# Altium schematic sheet 12 - MIPI-LVDS-RGB.SchDoc
size B; CompanyName: Microchip Technology Inc.; Organization: Microchip Technology; Address1: 2355 West Chandler Blvd.; Address2: Chandler, AZ  85224; Address4: USA; DocumentNumber: 12; SheetNumber: 12; SheetTotal: 15; SheetTitle: MIPI LVDS Connectors; Time: Time
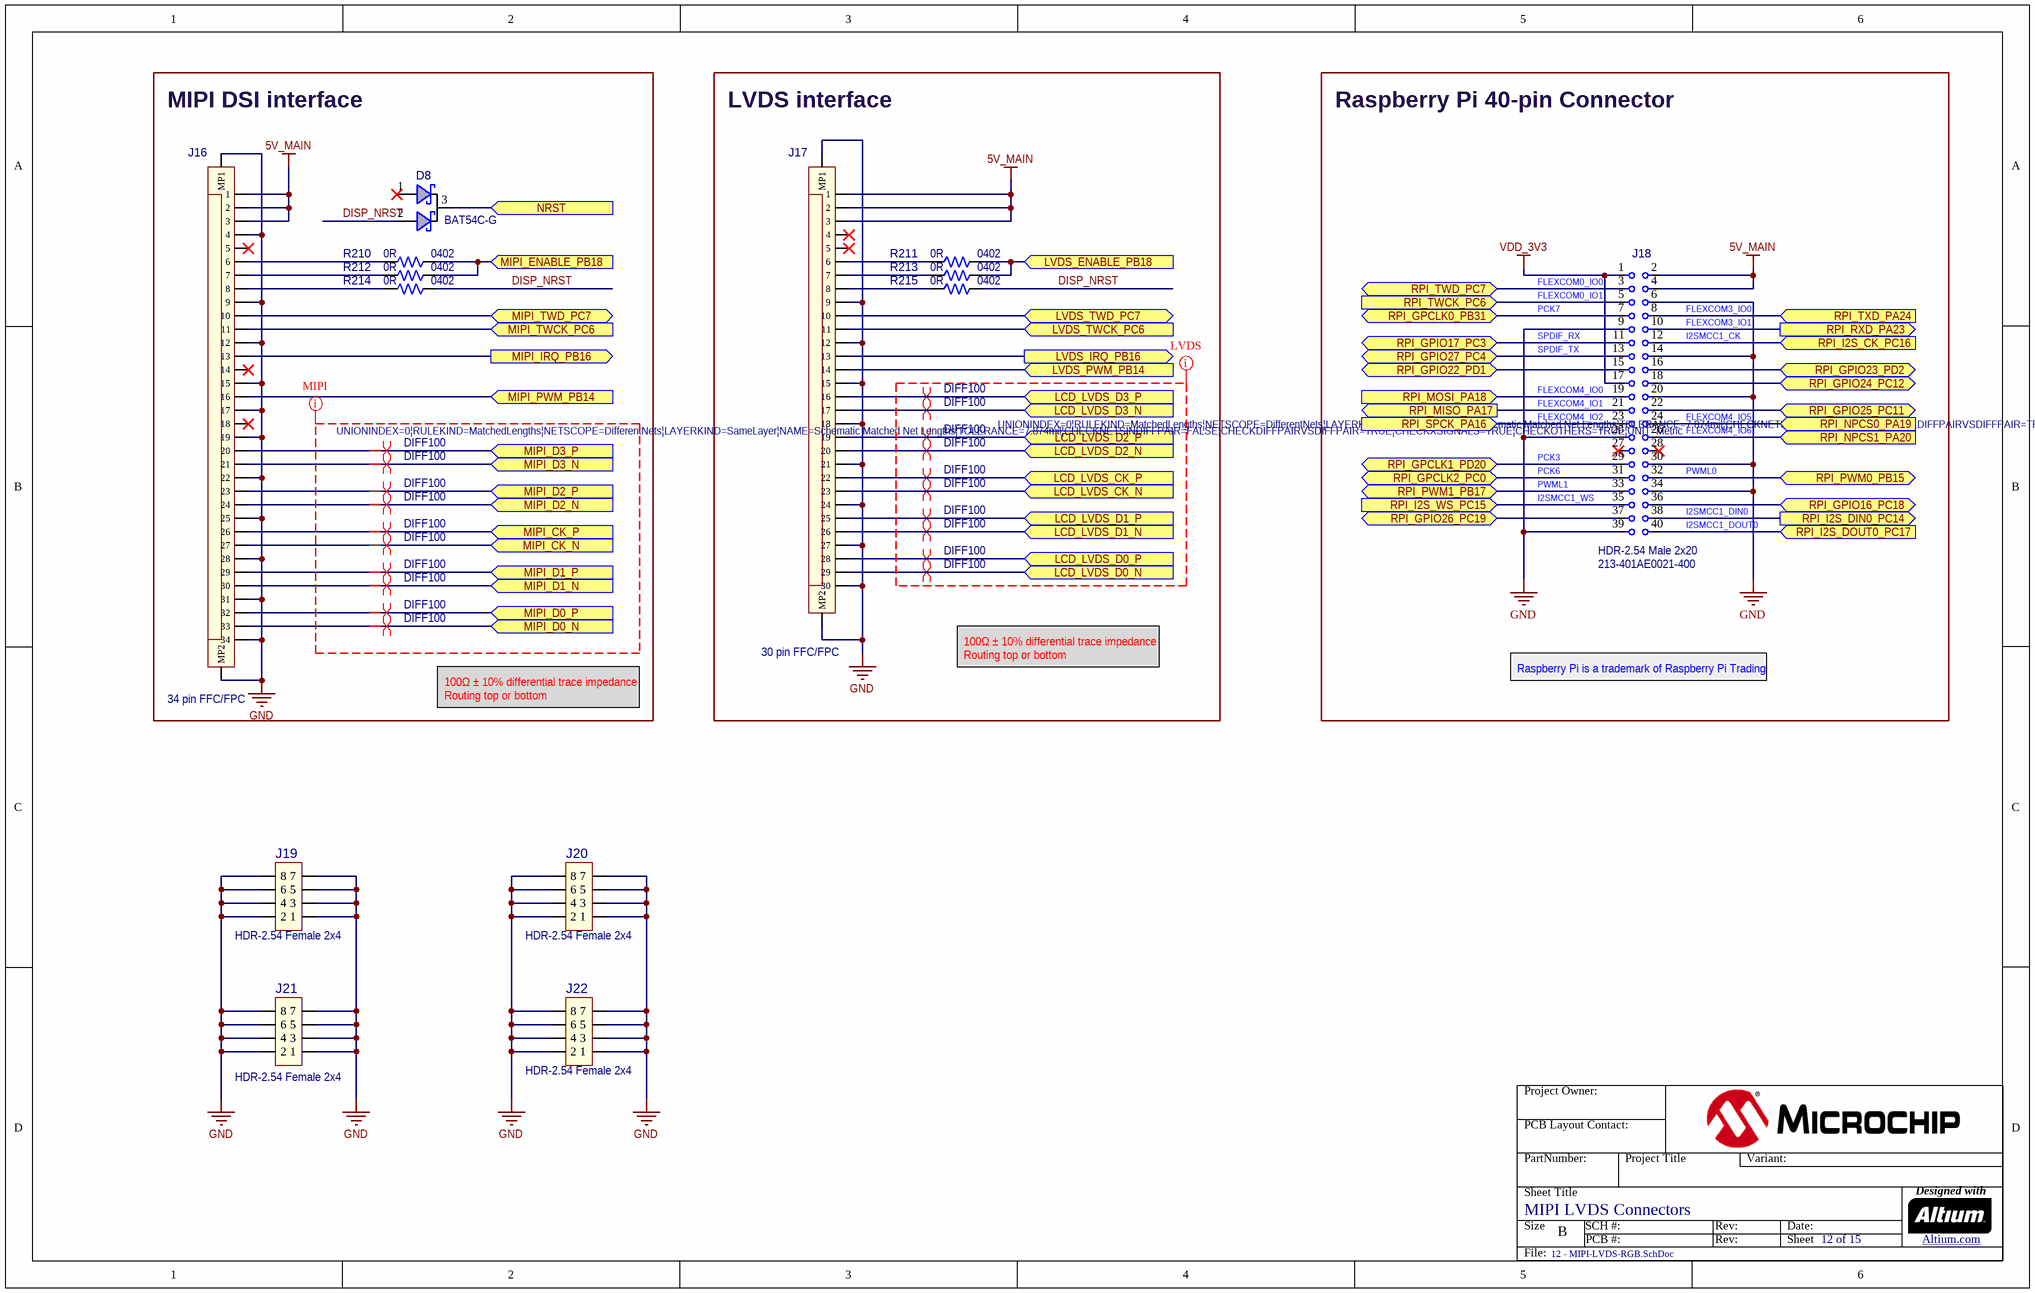
[diagram p0: 12 - MIPI-LVDS-RGB.SchDoc]

## Parts
D8  value BAT54C-G  [SOT-23-3]  (hidden comment: Diode Schottky Dual CK)
J16  value 34 pin FFC/FPC  [CON_FPC_0.5_FEMALE_2X17_SMD_AMPHENOL_F314-1A7H1-11034]  (hidden comment: CON FFC 1x34)
J17  value 30 pin FFC/FPC  [CON_FPC_0.5_FEMALE_2X15_SMD_MLX_52559-3052]  (hidden comment: CON FFC 1x30)
J18  value HDR-2.54 Male 2x20  Manufacturer Part Number 1: 213-401AE0021-400  [HDR_M_2.54_2x20]  (hidden comment: Header 2x20)
J19  value HDR-2.54 Female 2x4  [HDR_F_2.54_2x4]  (hidden comment: Header 2x4)
J20  value HDR-2.54 Female 2x4  [HDR_F_2.54_2x4]  (hidden comment: Header 2x4)
J21  value HDR-2.54 Female 2x4  [HDR_F_2.54_2x4]  (hidden comment: Header 2x4)
J22  value HDR-2.54 Female 2x4  [HDR_F_2.54_2x4]  (hidden comment: Header 2x4)
R210  value 0R  Package: 0402  [RES_C_0402]  (hidden comment: Resistor)
R211  value 0R  Package: 0402  [RES_C_0402]  (hidden comment: Resistor)
R212  value 0R  Package: 0402  [RES_C_0402]  (hidden comment: Resistor)
R213  value 0R  Package: 0402  [RES_C_0402]  (hidden comment: Resistor)
R214  value 0R  Package: 0402  [RES_C_0402]  (hidden comment: Resistor)
R215  value 0R  Package: 0402  [RES_C_0402]  (hidden comment: Resistor)

## Blocks framed on the sheet
MIPI DSI interface: D8 J16 R210 R212 R214
LVDS interface: J17 R211 R213 R215
Raspberry Pi 40-pin Connector: J18

## Ports
LCD_LVDS_CK_N (in), LCD_LVDS_CK_P (in), LCD_LVDS_D0_N (in), LCD_LVDS_D0_P (in), LCD_LVDS_D1_N (in), LCD_LVDS_D1_P (in), LCD_LVDS_D2_N (in), LCD_LVDS_D2_P (in), LCD_LVDS_D3_N (in), LCD_LVDS_D3_P (in), LVDS_ENABLE_PB18 (in), LVDS_IRQ_PB16 (out), LVDS_PWM_PB14 (in), LVDS_TWCK_PC6 (in), LVDS_TWD_PC7 (bidir), MIPI_CK_N (in), MIPI_CK_P (in), MIPI_D0_N (in), MIPI_D0_P (in), MIPI_D1_N (in), MIPI_D1_P (in), MIPI_D2_N (in), MIPI_D2_P (in), MIPI_D3_N (in), MIPI_D3_P (in), MIPI_ENABLE_PB18 (in), MIPI_IRQ_PB16 (out), MIPI_PWM_PB14 (in), MIPI_TWCK_PC6 (in), MIPI_TWD_PC7 (bidir), NRST (in), RPI_GPCLK0_PB31 (bidir), RPI_GPCLK1_PD20 (bidir), RPI_GPCLK2_PC0 (bidir), RPI_GPIO16_PC18 (bidir), RPI_GPIO17_PC3 (bidir), RPI_GPIO22_PD1 (bidir), RPI_GPIO23_PD2 (bidir), RPI_GPIO24_PC12 (bidir), RPI_GPIO25_PC11 (bidir), RPI_GPIO26_PC19 (bidir), RPI_GPIO27_PC4 (bidir), RPI_I2S_CK_PC16 (in), RPI_I2S_DIN0_PC14 (out), RPI_I2S_DOUT0_PC17 (in), RPI_I2S_WS_PC15 (in), RPI_MISO_PA17 (out), RPI_MOSI_PA18 (in), RPI_NPCS0_PA19 (in), RPI_NPCS1_PA20 (in), RPI_PWM0_PB15 (bidir), RPI_PWM1_PB17 (bidir), RPI_RXD_PA23 (out), RPI_SPCK_PA16 (in), RPI_TWCK_PC6 (in), RPI_TWD_PC7 (bidir), RPI_TXD_PA24 (in)

## Nets
5V_MAIN: J16.1 J16.2 J16.3 J17.1 J17.2 J17.3 J18.2 J18.4
GND: J16.4 J16.9 J16.12 J16.15 J16.17 J16.19 J16.22 J16.25 J16.28 J16.31 J16.34 J16.MP1 J16.MP2 J17.9 J17.12 J17.15 J17.18 J17.21 J17.24 J17.27 J17.30 J17.MP1 J17.MP2 J18.6 J18.9 J18.14 J18.20 J18.25 J18.30 J18.34 J18.39 J19.1 J19.2 J19.3 J19.4 J19.5 J19.6 J19.7 J19.8 J20.1 J20.2 J20.3 J20.4 J20.5 J20.6 J20.7 J20.8 J21.1 J21.2 J21.3 J21.4 J21.5 J21.6 J21.7 J21.8 J22.1 J22.2 J22.3 J22.4 J22.5 J22.6 J22.7 J22.8
VDD_3V3: J18.1 J18.17
DISP_NRST: D8.2(A) R214.2 R215.2
LCD_LVDS_CK_N: J17.23 ; port LCD_LVDS_CK_N
LCD_LVDS_CK_P: J17.22 ; port LCD_LVDS_CK_P
LCD_LVDS_D0_N: J17.29 ; port LCD_LVDS_D0_N
LCD_LVDS_D0_P: J17.28 ; port LCD_LVDS_D0_P
LCD_LVDS_D1_N: J17.26 ; port LCD_LVDS_D1_N
LCD_LVDS_D1_P: J17.25 ; port LCD_LVDS_D1_P
LCD_LVDS_D2_N: J17.20 ; port LCD_LVDS_D2_N
LCD_LVDS_D2_P: J17.19 ; port LCD_LVDS_D2_P
LCD_LVDS_D3_N: J17.17 ; port LCD_LVDS_D3_N
LCD_LVDS_D3_P: J17.16 ; port LCD_LVDS_D3_P
LVDS_ENABLE_PB18: R211.2 R213.2 ; port LVDS_ENABLE_PB18
LVDS_IRQ_PB16: J17.13 ; port LVDS_IRQ_PB16
LVDS_PWM_PB14: J17.14 ; port LVDS_PWM_PB14
LVDS_TWCK_PC6: J17.11 ; port LVDS_TWCK_PC6
LVDS_TWD_PC7: J17.10 ; port LVDS_TWD_PC7
MIPI_CK_N: J16.27 ; port MIPI_CK_N
MIPI_CK_P: J16.26 ; port MIPI_CK_P
MIPI_D0_N: J16.33 ; port MIPI_D0_N
MIPI_D0_P: J16.32 ; port MIPI_D0_P
MIPI_D1_N: J16.30 ; port MIPI_D1_N
MIPI_D1_P: J16.29 ; port MIPI_D1_P
MIPI_D2_N: J16.24 ; port MIPI_D2_N
MIPI_D2_P: J16.23 ; port MIPI_D2_P
MIPI_D3_N: J16.21 ; port MIPI_D3_N
MIPI_D3_P: J16.20 ; port MIPI_D3_P
MIPI_ENABLE_PB18: R210.2 R212.2 ; port MIPI_ENABLE_PB18
MIPI_IRQ_PB16: J16.13 ; port MIPI_IRQ_PB16
MIPI_PWM_PB14: J16.16 ; port MIPI_PWM_PB14
MIPI_TWCK_PC6: J16.11 ; port MIPI_TWCK_PC6
MIPI_TWD_PC7: J16.10 ; port MIPI_TWD_PC7
NRST: D8.3(KK) ; port NRST
RPI_GPCLK0_PB31: J18.7 ; port RPI_GPCLK0_PB31
RPI_GPCLK1_PD20: J18.29 ; port RPI_GPCLK1_PD20
RPI_GPCLK2_PC0: J18.31 ; port RPI_GPCLK2_PC0
RPI_GPIO16_PC18: J18.36 ; port RPI_GPIO16_PC18
RPI_GPIO17_PC3: J18.11 ; port RPI_GPIO17_PC3
RPI_GPIO22_PD1: J18.15 ; port RPI_GPIO22_PD1
RPI_GPIO23_PD2: J18.16 ; port RPI_GPIO23_PD2
RPI_GPIO24_PC12: J18.18 ; port RPI_GPIO24_PC12
RPI_GPIO25_PC11: J18.22 ; port RPI_GPIO25_PC11
RPI_GPIO26_PC19: J18.37 ; port RPI_GPIO26_PC19
RPI_GPIO27_PC4: J18.13 ; port RPI_GPIO27_PC4
RPI_I2S_CK_PC16: J18.12 ; port RPI_I2S_CK_PC16
RPI_I2S_DIN0_PC14: J18.38 ; port RPI_I2S_DIN0_PC14
RPI_I2S_DOUT0_PC17: J18.40 ; port RPI_I2S_DOUT0_PC17
RPI_I2S_WS_PC15: J18.35 ; port RPI_I2S_WS_PC15
RPI_MISO_PA17: J18.21 ; port RPI_MISO_PA17
RPI_MOSI_PA18: J18.19 ; port RPI_MOSI_PA18
RPI_NPCS0_PA19: J18.24 ; port RPI_NPCS0_PA19
RPI_NPCS1_PA20: J18.26 ; port RPI_NPCS1_PA20
RPI_PWM0_PB15: J18.32 ; port RPI_PWM0_PB15
RPI_PWM1_PB17: J18.33 ; port RPI_PWM1_PB17
RPI_RXD_PA23: J18.10 ; port RPI_RXD_PA23
RPI_SPCK_PA16: J18.23 ; port RPI_SPCK_PA16
RPI_TWCK_PC6: J18.5 ; port RPI_TWCK_PC6
RPI_TWD_PC7: J18.3 ; port RPI_TWD_PC7
RPI_TXD_PA24: J18.8 ; port RPI_TXD_PA24
NetJ16_6: J16.6 R210.1
NetJ16_7: J16.7 R212.1
NetJ16_8: J16.8 R214.1
NetJ17_6: J17.6 R211.1
NetJ17_7: J17.7 R213.1
NetJ17_8: J17.8 R215.1

Not connected (* = marked no-connect by the designer): D8 1(A)*; J16 5* 14* 18*; J17 4* 5*; J18 27* 28*

## Layout directives
differential pair; differential pair class DIFF100; net class DIFF100; rule Matched Net Lengths [Tolerance = 10mil]: LCD_LVDS_CK_N, LCD_LVDS_CK_P, LCD_LVDS_D0_N, LCD_LVDS_D0_P, LCD_LVDS_D1_N, LCD_LVDS_D1_P, LCD_LVDS_D2_N, LCD_LVDS_D2_P, LCD_LVDS_D3_N, LCD_LVDS_D3_P, MIPI_CK_N, MIPI_CK_P, MIPI_D0_N, MIPI_D0_P, MIPI_D1_N, MIPI_D1_P, MIPI_D2_N, MIPI_D2_P, MIPI_D3_N, MIPI_D3_P
net class MIPI; rule Matched Net Lengths [Tolerance = 0.2mm]: (no net found under the mark)
net class LVDS; rule Matched Net Lengths [Tolerance = 0.2mm]: (no net found under the mark)

## Notes on the sheet
- (near J18) FLEXCOM0_IO1
- (near J18) FLEXCOM0_IO0
- PCK7
- (near J18) SPDIF_TX
- (near J18) SPDIF_RX
- (near J18) FLEXCOM3_IO1
- (near J18) FLEXCOM3_IO0
- (near J18) I2SMCC1_CK
- (near J18) FLEXCOM4_IO0
- (near J18) FLEXCOM4_IO1
- (near J18) FLEXCOM4_IO2
- (near J18) FLEXCOM4_IO5
- (near J18) FLEXCOM4_IO6
- PCK3
- PCK6
- (near J18) I2SMCC1_WS
- PWML1
- (near J18) PWML0
- (near J18) I2SMCC1_DIN0
- (near J18) I2SMCC1_DOUT0
- 100Ω ± 10% differential trace impedance
  Routing top or bottom
- Raspberry Pi is a trademark of Raspberry Pi Trading
- Project Owner:
- PCB Layout Contact:
- PartNumber:
- Project Title
- Variant:
- Sheet Title
- Size
- B
- SCH #:
- PCB #:
- Rev:
- Date:
- Sheet
- Designed with
- Altium.com <http://go.altium.com/MicrochipLandingPage_Evaluation.html>
- File:

## Library data of the parts
D8 = DIODE1841: Manufacturer 1: Comchip Technology; Description_: DIO SCTKY ARRAY BAT54C-G 520mV 200mA 30V SMD SOT-23-3; Dev Tools Status: Production; Type: Schottky Array; Forward Current: 200mA; Power: 225mW; Reverse Current: 2mA; Reverse Recovery Time: 5ns; Reverse Voltage: 30V; Owner: Cristina Salanti; Populated: YES; Restricted Sourcing: No; MCHP-ID: DIODE1841; Revision: 1; Symbol: Diode Schottky Dual CK; Status: MCL Design; Package: SOT-23-3; ComponentLink1URL: https://chn-vm-apps.microchip.com/mchprepo/parts/Datasheets/BAT54.pdf; ComponentLink1Description: SVN Datasheet; ComponentLink2URL: C:\ALTIUM_WORK\00001_MCHP-CDB\Datasheets\BAT54.pdf; ComponentLink2Description: Local Datasheet; ComponentLink3URL: C:\ALTIUM_WORK\00001_MCHP-CDB\Library\LibraryRefs\Diode Schottky Dual CK.SchLib; ComponentLink3Description: Open Symbol; ComponentLink4URL: C:\ALTIUM_WORK\00001_MCHP-CDB\Library\Footprints\SOT-23-3.PcbLib; ComponentLink4Description: Open Footprint; ComponentLink5Description: Open Footprint 2; ComponentLink6Description: Open Footprint 3; ComponentLink7Description: Open Footprint 4; Operating Temperature: -55C to +125C; Category: Diode; Manufacturer Part Number 1: BAT54C-G; Supplier 1: Digi-Key; Supplier Part Number 1: 641-1320-1-ND; Quantity Override: 1
J16 = CON2719: Manufacturer 1: Amphenol Aorora; Manufacturer Part Number 1: F314-1A7H1-11034; Description_: CON FFC/FPC 0.5mm 34P Female SMD; Dev Tools Status: Production; Owner: Dragos Danaila; Voltage: 50V; Current: 0.5A; Populated: YES; Restricted Sourcing: No; MCHP-ID: CON2719; Revision: 1; Symbol: CON FFC 1x34; Status: MCL Design; ComponentLink1URL: https://chn-vm-apps.microchip.com/mchprepo/parts/Datasheets/ffc_fpc_050mm_f31w_f31z_f314_f336.pdf; ComponentLink1Description: SVN Datasheet; ComponentLink2URL: C:\ALTIUM_WORK\00001_MCHP-CDB\Datasheets\ffc_fpc_050mm_f31w_f31z_f314_f336.pdf; ComponentLink2Description: Local Datasheet; ComponentLink3URL: C:\ALTIUM_WORK\00001_MCHP-CDB\Library\LibraryRefs\CON FFC 1x34.SchLib; ComponentLink3Description: Open Symbol; ComponentLink4URL: C:\ALTIUM_WORK\00001_MCHP-CDB\Library\Footprints\CON_FPC_0.5_FEMALE_2X17_SMD_AMPHENOL_F314-1A7H1-11034.PcbLib; ComponentLink4Description: Open Footprint; ComponentLink5Description: Open Footprint 2; ComponentLink6Description: Open Footprint 3; ComponentLink7Description: Open Footprint 4; Type: FFC/FPC; Category: Connector; Supplier 1: Mouser; Supplier Part Number 1: 649-F314-1A7H1-11034; Quantity Override: 1; Operating Temperature: -40C to +105C; Assembly Type: SMD
J17 = CON2563: Manufacturer 1: Molex; Manufacturer Part Number 1: 0525593052; Description_: CON FFC/FPC 0.5mm 30P Female SMD; Dev Tools Status: Design; Owner: Dragos Danaila; Voltage: 50V; Current: 0.5A; Populated: YES; MCHP-ID: CON2563; Revision: 1; Symbol: CON FFC 1x30; Status: MCL Design; ComponentLink1URL: https://chn-vm-apps.microchip.com/mchprepo/parts/Datasheets/525593052_sd.pdf; ComponentLink1Description: SVN Datasheet; ComponentLink2URL: C:\ALTIUM_WORK\00001_MCHP-CDB\Datasheets\525593052_sd.pdf; ComponentLink2Description: Local Datasheet; ComponentLink3URL: C:\ALTIUM_WORK\00001_MCHP-CDB\Library\LibraryRefs\CON FFC 1x30.SchLib; ComponentLink3Description: Open Symbol; ComponentLink4URL: C:\ALTIUM_WORK\00001_MCHP-CDB\Library\Footprints\CON_FPC_0.5_FEMALE_2X15_SMD_MLX_52559-3052.PcbLib; ComponentLink4Description: Open Footprint; ComponentLink5Description: Open Footprint 2; ComponentLink6Description: Open Footprint 3; ComponentLink7Description: Open Footprint 4; Type: FFC/FPC; Category: Connector; Supplier 1: Digi-Key; Supplier Part Number 1: WM7987TR-ND; Quantity Override: 1; Operating Temperature: -40C to +85C; Assembly Type: SMD
J18 = CON0153: Manufacturer 1: SHENZHEN JUNHAO ENGINEERING; Description_: CON HDR-2.54 Male 2x20 Gold 5.84MH TH VERT; Dev Tools Status: Production; Owner: Stephen Humberd; Populated: YES; Restricted Sourcing: No; MCHP-ID: CON0153; Revision: 2; Symbol: Header 2x20; Status: MCL Design; ComponentLink1URL: https://chn-vm-apps.microchip.com/mchprepo/parts/Datasheets/TSW-XXX-XX-XXX-X-XX-XXX-MKT.pdf; ComponentLink1Description: SVN Datasheet; ComponentLink2URL: C:\ALTIUM_WORK\00001_MCHP-CDB\Datasheets\TSW-XXX-XX-XXX-X-XX-XXX-MKT.pdf; ComponentLink2Description: Local Datasheet; ComponentLink3URL: C:\ALTIUM_WORK\00001_MCHP-CDB\Library\LibraryRefs\Header 2x20.SchLib; ComponentLink3Description: Open Symbol; ComponentLink4URL: C:\ALTIUM_WORK\00001_MCHP-CDB\Library\Footprints\HDR_M_2.54_2x20.PcbLib; ComponentLink4Description: Open Footprint; ComponentLink5Description: Open Footprint 2; ComponentLink6Description: Open Footprint 3; ComponentLink7Description: Open Footprint 4; Type: Header 2.54mm; Category: Connector; Manufacturer 2: Samtec; Manufacturer Part Number 2: TSW-120-07-S-D; Supplier 1: SHENZHEN JUNHAO ENGINEERING; Supplier Part Number 1: 213-401AE0021-400; Supplier 2: Samtec; Supplier Part Number 2: TSW-120-07-S-D; Quantity Override: 1; Manufacturer 3: Samtec; Manufacturer Part Number 3: TSW-120-07-G-D; Supplier 3: Samtec; Supplier Part Number 3: TSW-120-07-G-D
J19-J22 = CON1359: Manufacturer 1: Sullins Connector Solutions; Manufacturer Part Number 1: PPPC042LFBN-RC; Description_: CON HDR-2.54 Female 2x4 Gold TH; Dev Tools Status: Design; Owner: Jamus Griego; Populated: YES; MCHP-ID: CON1359; Revision: A; Symbol: Header 2x4; Status: MCL Design; ComponentLink1URL: https://chn-vm-apps.microchip.com/mchprepo/parts/Datasheets/78_P(N)PxCxxxLFBN-RC,_10492-G.pdf; ComponentLink1Description: SVN Datasheet; ComponentLink2URL: C:\ALTIUM_WORK\00001_MCHP-CDB\Datasheets\78_P(N)PxCxxxLFBN-RC,_10492-G.pdf; ComponentLink2Description: Local Datasheet; ComponentLink3URL: C:\ALTIUM_WORK\00001_MCHP-CDB\Library\LibraryRefs\Header 2x4.SchLib; ComponentLink3Description: Open Symbol; ComponentLink4URL: C:\ALTIUM_WORK\00001_MCHP-CDB\Library\Footprints\HDR_F_2.54_2x4.PcbLib; ComponentLink4Description: Open Footprint; ComponentLink5Description: Open Footprint 2; ComponentLink6Description: Open Footprint 3; ComponentLink7Description: Open Footprint 4; Type: Header 2.54mm; Category: Connector; Supplier 1: Digi-Key; Supplier Part Number 1: S7107-ND; Quantity Override: 1
R210-R215 = RSMT1040: Manufacturer 1: Yageo; Manufacturer Part Number 1: RC0402JR-070RL; Description_: RES TKF 0R 1/16W SMD 0402; Dev Tools Status: Production; Power: 1/16W; Populated: Yes; Owner: Sompoch Loboonlert; MCHP-ID: RSMT1040; Revision: 3; Symbol: Resistor; Status: MCL Design; ComponentLink1URL: https://chn-vm-apps.microchip.com/mchprepo/parts/Datasheets/PYu-RC0402_51_RoHS_L_6.pdf; ComponentLink1Description: SVN Datasheet; ComponentLink2URL: C:\ALTIUM_WORK\00001_MCHP-CDB\Datasheets\PYu-RC0402_51_RoHS_L_6.pdf; ComponentLink2Description: Local Datasheet; ComponentLink3URL: C:\ALTIUM_WORK\00001_MCHP-CDB\Library\LibraryRefs\Resistor.SchLib; ComponentLink3Description: Open Symbol; ComponentLink4URL: C:\ALTIUM_WORK\00001_MCHP-CDB\Library\Footprints\RES_C_0402.PcbLib; ComponentLink4Description: Open Footprint; ComponentLink5Description: Open Footprint 2; ComponentLink6Description: Open Footprint 3; ComponentLink7Description: Open Footprint 4; Operating Temperature: -55C to +155C; Category: Resistor; Type: RES SMD; Composition: TKF; Supplier 1: Digi-Key; Supplier Part Number 1: 311-0.0JRCT-ND; Quantity Override: 1; Manufacturer 2: Stackpole Electronics Inc; Manufacturer Part Number 2: RMCF0402ZT0R00; Supplier 2: Digi-Key; Supplier Part Number 2: RMCF0402ZT0R00TR-ND